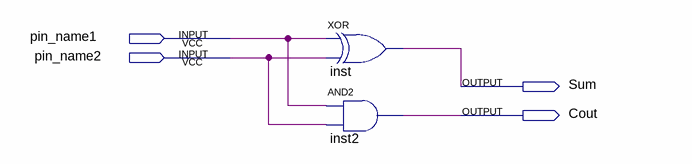
[diagram p0: schematic sheet]
// Quartus schematic half_adder.bdf as structural Verilog: 2 symbols, 4 pins
module half_adder (
  input  pin_name1,
  input  pin_name2,
  output Sum,
  output Cout
);

  xor inst (Sum, pin_name1, pin_name2);
  and inst2 (Cout, pin_name1, pin_name2);
endmodule
